# EAGLE design Decoder_relay_4bit_Compact_REV.0 (EAGLE 9.6.2)
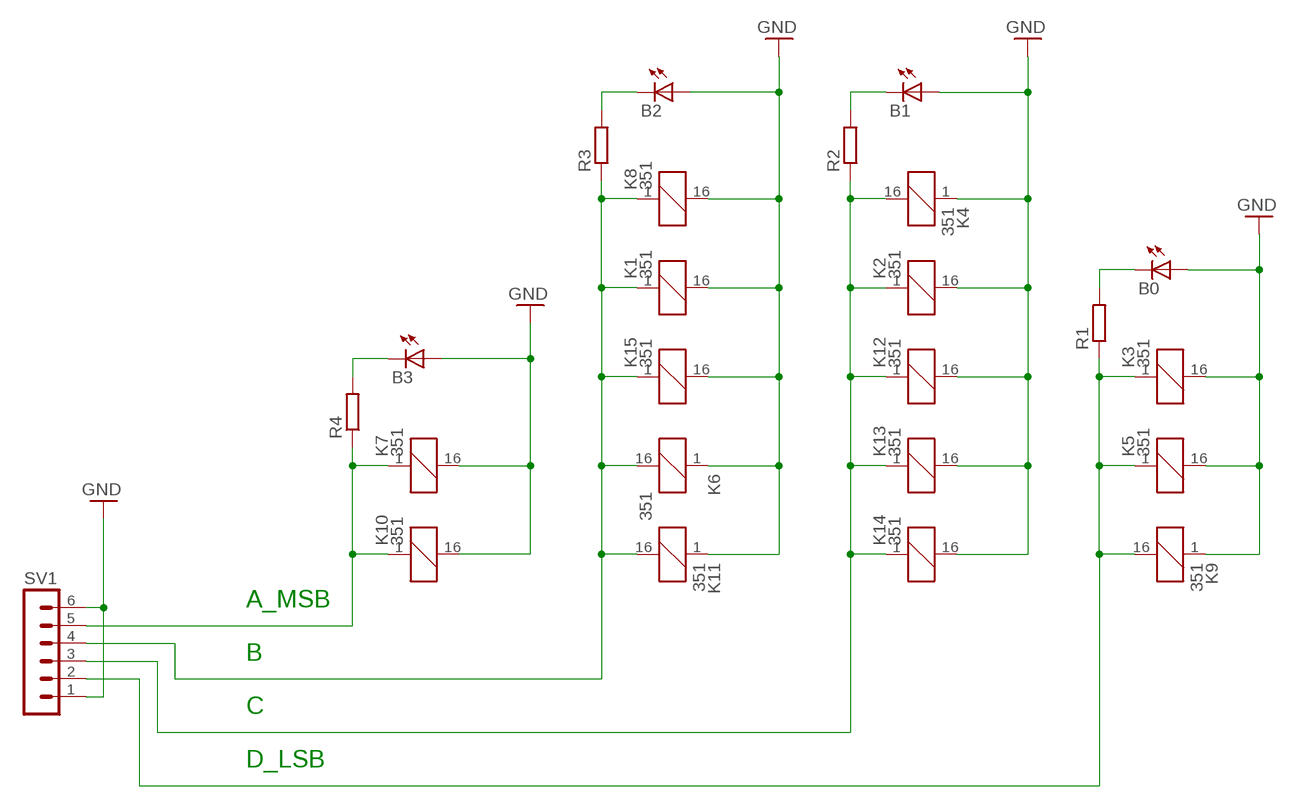
[diagram p0: schematic, sheet 1, part 1 of 2]
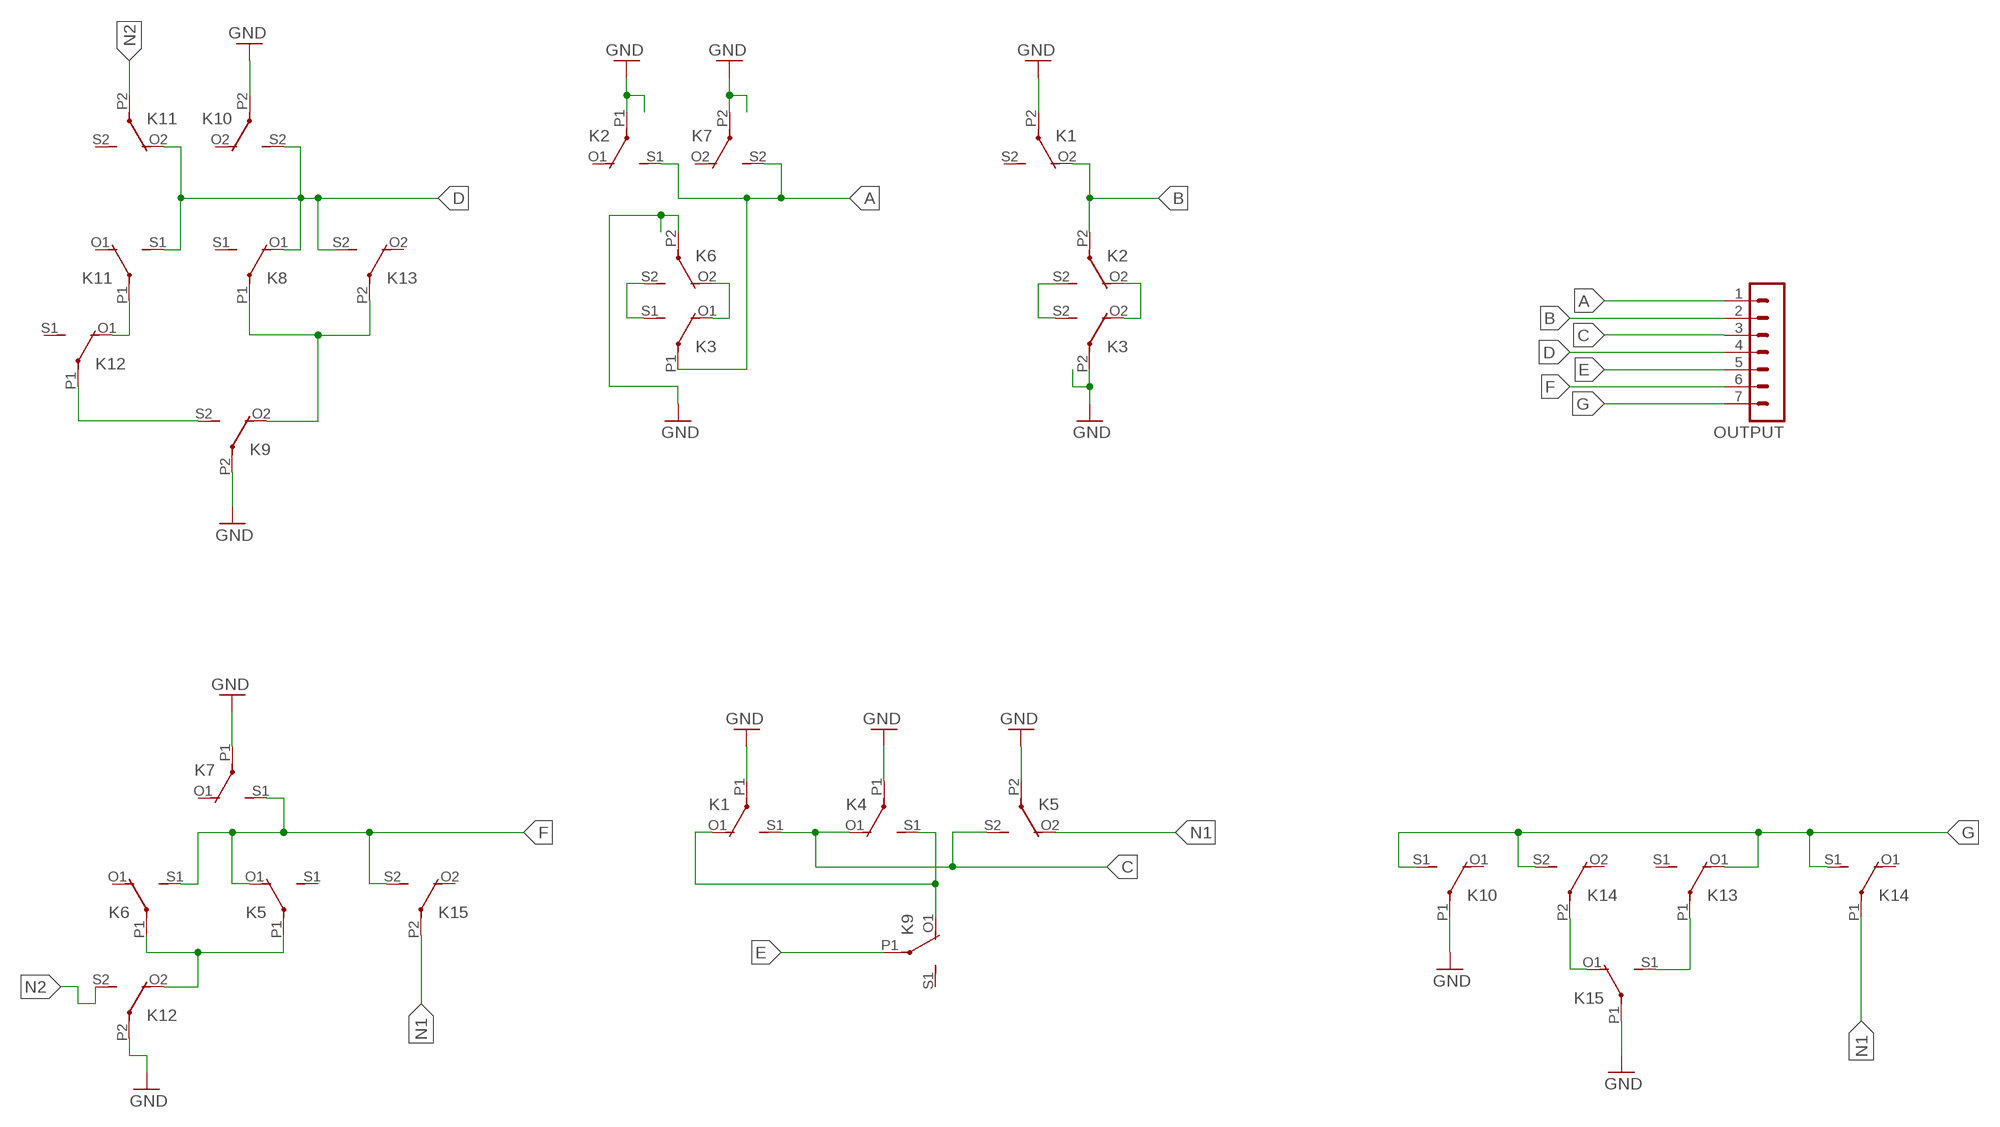
[diagram p1: schematic, sheet 1, part 2 of 2]

## Parts
B0  LED3MM  [LED3MM]
B1  LED3MM  [LED3MM]
B2  LED3MM  [LED3MM]
B3  LED3MM  [LED3MM]
K1  351  [351]
K2  351  [351]
K3  351  [351]
K4  351  [351]
K5  351  [351]
K6  351  [351]
K7  351  [351]
K8  351  [351]
K9  351  [351]
K10  351  [351]
K11  351  [351]
K12  351  [351]
K13  351  [351]
K14  351  [351]
K15  351  [351]
OUTPUT  MA07-1  [MA07-1]
R1  R-EU_M0805  [M0805]
R2  R-EU_M0805  [M0805]
R3  R-EU_M0805  [M0805]
R4  R-EU_M0805  [M0805]
SV1  MA06-1  [MA06-1]

## Nets
A: K2.S1(2:S) K3.P1(2:P) K7.S2(3:S) OUTPUT.1
A3: K7.1 K10.1 R4.1 SV1.5
B: K1.O2(3:O) K2.P2(3:P) OUTPUT.2
C: K1.S1(2:S) K4.O1(2:O) K5.S2(3:S) OUTPUT.3
D: K8.O1(2:O) K10.S2(3:S) K11.O2(3:O) K11.S1(2:S) K13.S2(3:S) OUTPUT.4
E: K9.P1(2:P) OUTPUT.5
F: K5.O1(2:O) K6.S1(2:S) K7.S1(2:S) K15.S2(3:S) OUTPUT.6
G: K10.S1(2:S) K13.O1(2:O) K14.S1(2:S) K14.S2(3:S) OUTPUT.7
GND: B0.A B1.A B2.A B3.A K1.16 K1.P1(2:P) K1.P2(3:P) K2.16 K2.P1(2:P) K3.16 K3.P2(3:P) K4.1 K4.P1(2:P) K5.16 K5.P2(3:P) K6.1 K6.P2(3:P) K7.16 K7.P1(2:P) K7.P2(3:P) K8.16 K9.1 K9.P2(3:P) K10.16 K10.P1(2:P) K10.P2(3:P) K11.1 K12.16 K12.P2(3:P) K13.16 K14.16 K15.16 K15.P1(2:P) SV1.1 SV1.6
N1: K5.O2(3:O) K14.P1(2:P) K15.P2(3:P)
N2: K11.P2(3:P) K12.S2(3:S)
N$2: K8.P1(2:P) K9.O2(3:O) K13.P2(3:P)
N$3: B0.K(C) R1.2
N$4: K2.S2(3:S) K3.S2(3:S)
N$5: B1.K(C) R2.2
N$6: K3.S1(2:S) K6.S2(3:S)
N$8: B2.K(C) R3.2
N$9: B3.K(C) R4.2
N$12: K5.P1(2:P) K6.P1(2:P) K12.O2(3:O)
N$13: K2.O2(3:O) K3.O2(3:O)
N$15: K13.P1(2:P) K15.S1(2:S)
N$16: K14.P2(3:P) K15.O1(2:O)
N$17: K9.S2(3:S) K12.P1(2:P)
N$19: K11.P1(2:P) K12.O1(2:O)
N$26: K3.O1(2:O) K6.O2(3:O)
N$55: K1.O1(2:O) K4.S1(2:S) K9.O1(2:O)
N$58: K1.1 K6.16 K8.1 K11.16 K15.1 R3.1 SV1.4
N$63: K3.1 K5.1 K9.16 R1.1 SV1.2
N$69: K2.1 K4.16 K12.1 K13.1 K14.1 R2.1 SV1.3
Unconnected: K1.S2(3:S) K2.O1(2:O) K4.O2(3:O) K4.P2(3:P) K4.S2(3:S) K5.S1(2:S) K6.O1(2:O) K7.O1(2:O) K7.O2(3:O) K8.O2(3:O) K8.P2(3:P) K8.S1(2:S) K8.S2(3:S) K9.S1(2:S) K10.O1(2:O) K10.O2(3:O) K11.O1(2:O) K11.S2(3:S) K12.S1(2:S) K13.O2(3:O) K13.S1(2:S) K14.O1(2:O) K14.O2(3:O) K15.O2(3:O)

## Notes on the sheet
- A_MSB
- B
- C
- D_LSB

## Library data of the parts
B0 B1-B3 = led:LED: LED OSRAM: - CHIPLED LG R971, LG N971, LY N971, LG Q971, LY Q971, LO R971, LY R971 LH N974, LH R974 LS Q976, LO Q976, LY Q976 LO Q996 - Hyper CHIPLED LW Q18S LB Q993, LB Q99A, LB R99A - SideLED LS A670, LO A670, LY A670, LG A670, LP A670 LB A673, LV A673, LT A673, LW A673 LH A674 LY A675 LS A676, LA A676, LO A676, LY A676, LW A676 LS A679, LY A679, LG A679 - Hyper Micro SIDELED® LS Y876, LA Y876, LO Y876, LY Y876 LT Y87S - SmartLED LW L88C, LW L88S LB L89C, LB L89S, LG L890 LS L89K, LO L89K, LY L89K LS L896, LA L896, LO L896, LY L896 - TOPLED LS T670, LO T670, LY T670, LG T670, LP T670 LSG T670, LSP T670, LSY T670, LOP T670, LYG T670 LG T671, LOG T671, LSG T671 LB T673, LV T673, LT T673, LW T673 LH T674 LS T676, LA T676, LO T676, LY T676, LB T676, LH T676, LSB T676, LW T676 LB T67C, LV T67C, LT T67C, LS T67K, LO T67K, LY T67K, LW E67C LS E67B, LA E67B, LO E67B, LY E67B, LB E67C, LV E67C, LT E67C LW T67C LS T679, LY T679, LG T679 LS T770, LO T770, LY T770, LG T770, LP T770 LB T773, LV T773, LT T773, LW T773 LH T774 LS E675, LA E675, LY E675, LS T675 LS T776, LA T776, LO T776, LY T776, LB T776 LHGB T686 LT T68C, LB T68C - Hyper Mini TOPLED® LB M676 - Mini TOPLED Santana® LG M470 LS M47K, LO M47K, LY M47K Source: http://www.osram.convergy.de LUXEON: - LUMILED® LXK2-PW12-R00, LXK2-PW12-S00, LXK2-PW14-U00, LXK2-PW14-V00 LXK2-PM12-R00, LXK2-PM12-S00, LXK2-PM14-U00 LXK2-PE12-Q00, LXK2-PE12-R00, LXK2-PE12-S00, LXK2-PE14-T00, LXK2-PE14-U00 LXK2-PB12-K00, LXK2-PB12-L00, LXK2-PB12-M00, LXK2-PB14-N00, LXK2-PB14-P00, LXK2-PB14-Q00 LXK2-PR12-L00, LXK2-PR12-M00, LXK2-PR14-Q00, LXK2-PR14-R00 LXK2-PD12-Q00, LXK2-PD12-R00, LXK2-PD12-S00 LXK2-PH12-R00, LXK2-PH12-S00 LXK2-PL12-P00, LXK2-PL12-Q00, LXK2-PL12-R00 Source: www.luxeon.com KINGBRIGHT: KA-3528ASYC Source: www.kingbright.com
K1-K15 = relay:351: RELAY 2 x switch, Omron; OC_FARNELL: unknown; OC_NEWARK: unknown
OUTPUT = con-lstb:MA07-1: PIN HEADER; OC_FARNELL: unknown; OC_NEWARK: unknown
R1-R4 = rcl:R-EU_: RESISTOR, European symbol
SV1 = con-lstb:MA06-1: PIN HEADER; OC_FARNELL: unknown; OC_NEWARK: unknown

## Board
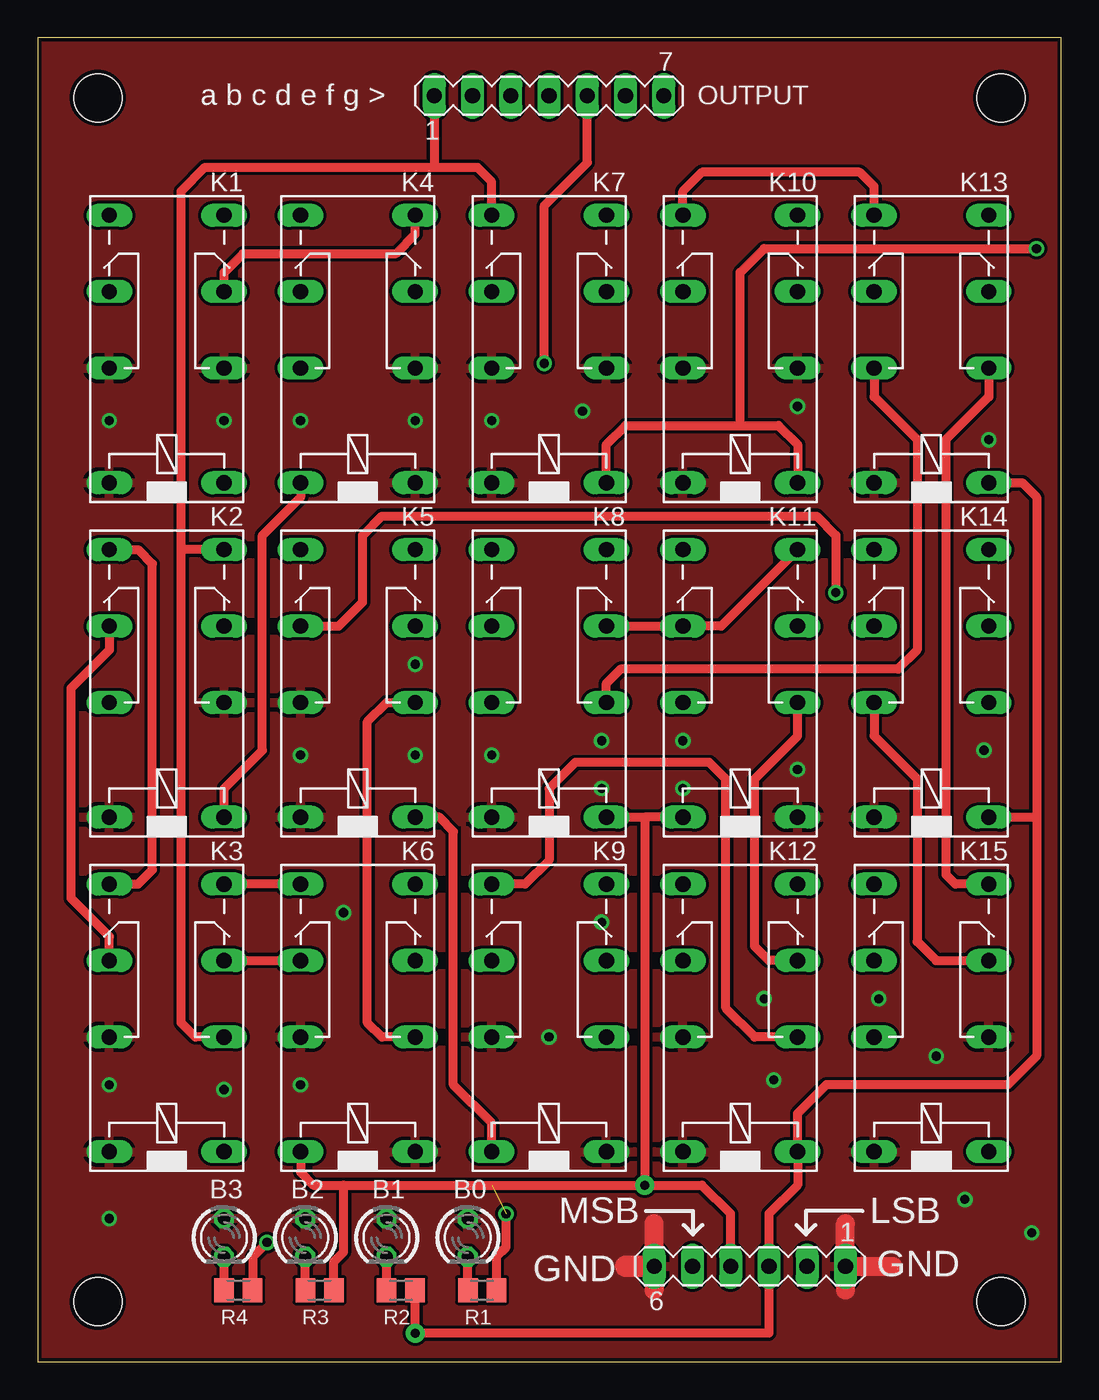
[diagram p2: board, top side]
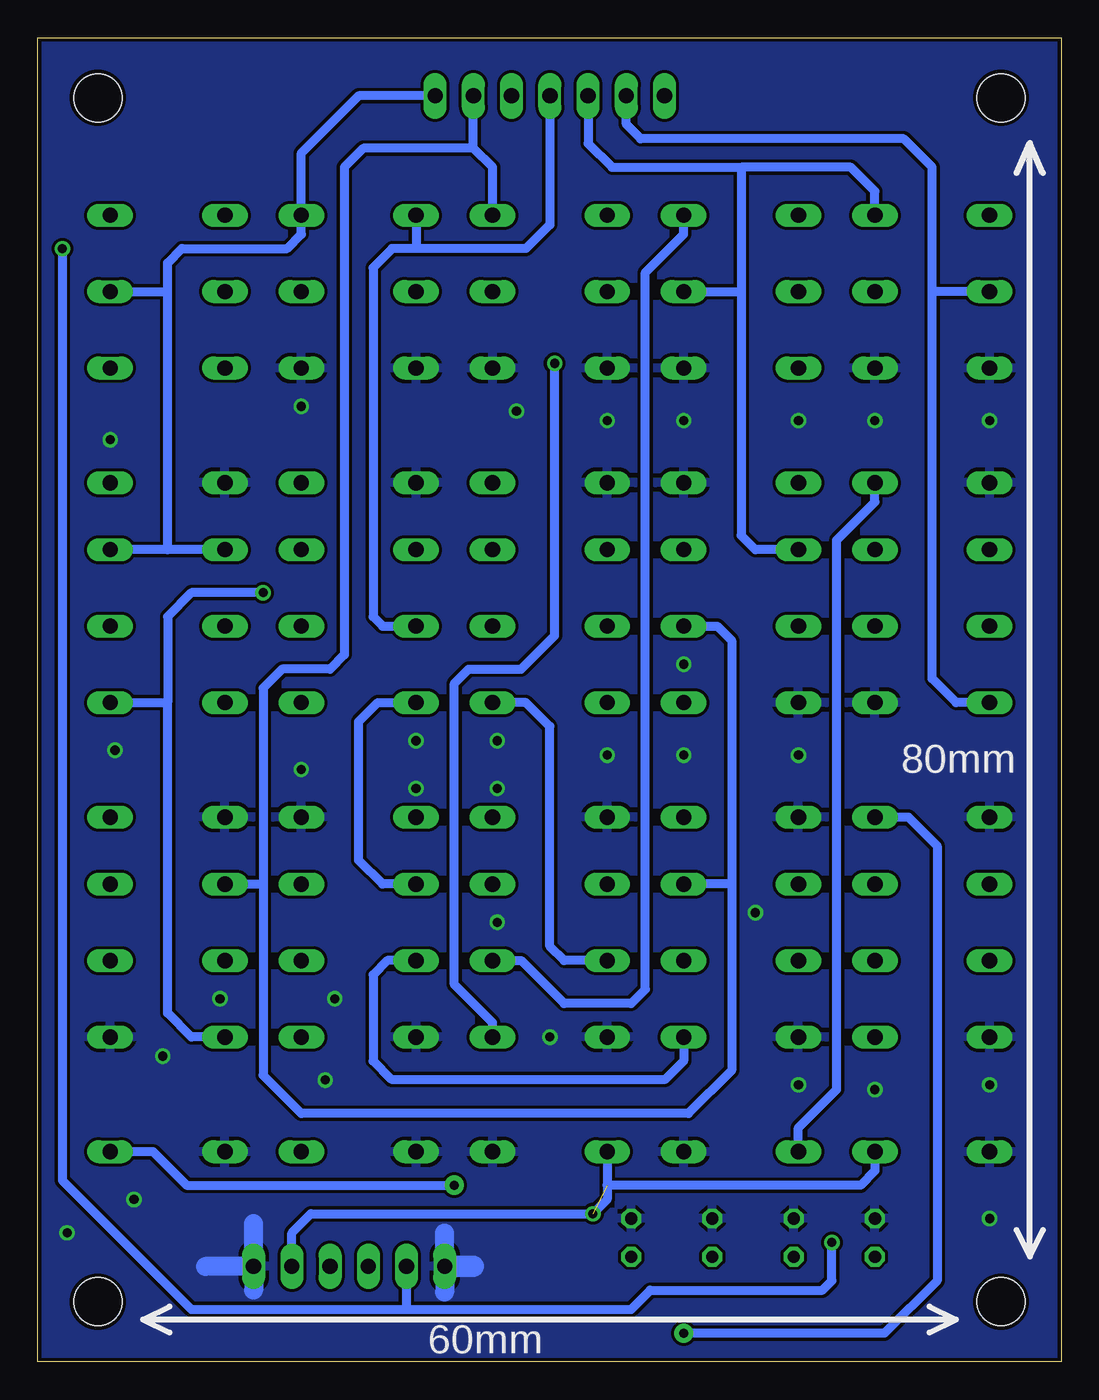
[diagram p3: board, bottom side, seen from below]

Size 68 x 88 mm. Coordinates in mm from the lower left corner, seen from the top.
Outline: 0,0 68,0 68,88 0,88 0,0
Copper layers (1*16): Top 0.035mm / dielectric 1.5mm / Bottom 0.035mm
Design rules "default *": minimum track width 24mil, minimum drill 24mil, track to track 8mil, track to pad 8mil, pad to pad 8mil, via to via 8mil, smd to smd 8mil, copper to edge 10mil, drill to drill 8mil, minimum pad ring 10mil, minimum via ring 8mil, stop-mask expansion 4mil, vias tented up to drill 0mil, thermal gap 10mil
Holes 3.2 mm at 64,84 4,4 4,84 64,4

### Footprints (pad centres in the part's own frame; a part is rotated, then mirrored left to right if it is on the bottom)
LED3MM = drill 0.813 octagon: A -1.27,0; K 1.27,0
351 = drill 1.016 long: 1 -3.81,-3.81; 16 -3.81,3.81; O1 8.89,-3.81; O2 8.89,3.81; P1 3.81,-3.81; P2 3.81,3.81; S1 13.97,-3.81; S2 13.97,3.81
MA07-1 = drill 1.016 long: 1 -7.62,0; 2 -5.08,0; 3 -2.54,0; 4 0,0; 5 2.54,0; 6 5.08,0; 7 7.62,0
M0805 = smd 1.3 x 1.6: 1 -0.95,0; 2 0.95,0
MA06-1 = drill 1.016 long: 1 -6.35,0; 2 -3.81,0; 3 -1.27,0; 4 1.27,0; 5 3.81,0; 6 6.35,0

### Placement (x,y rotation side)
B0  28.57,8.26 270 top
B1  23.18,8.26 270 top
B2  17.78,8.26 270 top
B3  12.38,8.26 270 top
K1  8.57,62.23 90 top
K2  8.57,40.01 90 top
K3  8.57,17.78 90 top
K4  21.27,62.23 90 top
K5  21.27,40.01 90 top
K6  21.27,17.78 90 top
K7  33.97,62.23 90 top
K8  33.97,40.01 90 top
K9  33.97,17.78 90 top
K10  46.67,62.23 90 top
K11  46.67,40.01 90 top
K12  46.67,17.78 90 top
K13  59.37,62.23 90 top
K14  59.37,40.01 90 top
K15  59.37,17.78 90 top
OUTPUT  33.97,84.14 0 top
R1  29.53,4.76 180 top
R2  24.13,4.76 180 top
R3  18.73,4.76 180 top
R4  13.34,4.76 180 top
SV1  47.31,6.35 180 top

### Tracks (layer width: path | path; a pad name or v marks a point on that pad's centre or on a via)
A
  Top 0.61: K3.P1 10.48,21.59 9.53,22.54 9.53,53.98 | 9.53,53.98 9.53,77.79 11.11,79.38 26.35,79.38 | K2.S1 9.53,53.98 | 26.35,79.38 29.21,79.38 30.16,78.42 K7.S2 | OUTPUT.1 26.35,79.38
A3  (via drill 0.61)
  Top 0.61: K7.1 37.78,60.96 39.05,62.23 46.67,62.23 | 46.67,62.23 49.21,62.23 50.48,60.96 K10.1 | 46.67,62.23 46.67,72.39 48.26,73.98 v66.36,73.98 | v15.24,7.94 14.29,6.98 R4.1
  Bottom 0.61: 43.5,3.49 57.78,3.49 66.36,12.06 v66.36,73.98 | SV1.5 43.5,3.49 | 43.5,3.49 28.57,3.49 27.3,4.76 15.88,4.76 15.24,5.4 v15.24,7.94
B
  Bottom 0.61: 8.57,71.12 8.57,45.4 6.99,43.81 K2.P2 | 8.57,71.12 8.57,79.38 10.48,81.28 27.94,81.28 28.89,82.23 OUTPUT.2 | K1.O2 8.57,71.12
C
  Bottom 0.61: K1.S1 12.38,77.79 13.97,79.38 21.27,79.38 | K5.S2 20.32,53.98 21.27,54.93 21.27,71.12 | 21.27,79.38 21.27,71.12 | K4.O1 21.27,71.12 | OUTPUT.3 31.43,80.96 29.84,79.38 21.27,79.38
D
  Top 0.61: K11.S1 45.4,48.9 K11.O2 K8.O1 | K10.S2 42.86,77.79 44.13,79.06 54.61,79.06 55.56,78.11 K13.S2
  Bottom 0.61: OUTPUT.4 33.97,75.56 35.56,73.98 42.86,73.98 | K10.S2 42.86,73.98 | 42.86,73.98 44.45,73.98 45.72,72.71 45.72,49.53 45.09,48.9 K11.O2
E  (via drill 0.61)
  Top 0.61: v33.66,66.36 33.66,76.83 36.51,79.69 OUTPUT.5
  Bottom 0.61: K9.P1 37.78,22.54 40.32,25.08 40.32,45.09 39.37,46.04 35.88,46.04 33.66,48.26 v33.66,66.36
F
  Bottom 0.61: 21.91,31.75 K6.S1 | K5.O1 22.86,48.9 21.91,47.94 21.91,31.75 | K7.S1 37.78,79.38 39.05,80.64 | 39.05,80.64 OUTPUT.6 | 39.05,80.64 46.35,80.64 47.62,79.38 47.62,46.99 48.58,46.04 51.75,46.04 53.02,44.77 53.02,31.75 | 21.91,31.75 21.91,19.37 24.77,16.51 50.48,16.51 53.02,19.05 53.02,31.75 | K15.S2 53.02,31.75
G
  Bottom 0.61: K14.S2 59.37,53.98 | 59.37,53.98 K14.S1 | OUTPUT.7 46.67,84.14 50.48,80.33 K10.S1 50.48,74.93 51.44,73.98 58.42,73.98 59.37,73.03 59.37,71.12 | 59.37,53.98 59.37,71.12 | K13.O1 59.37,71.12
GND  (via drill 0.61)
  Top 1.27: SV1.1 56.83,6.35 | SV1.1 53.66,9.21 | SV1.1 53.66,4.76 | 40.96,9.21 SV1.6 40.96,4.76
  Top 1.422: 39.05,6.35 SV1.6
  Bottom 1.27: 40.96,8.57 SV1.6 40.96,4.64 | SV1.1 53.66,4.76 | SV1.1 53.66,9.21 | SV1.1 56.83,6.35
  Bottom 1.422: 39.05,6.35 SV1.6
  other vias: 25.08,40.32 25.08,46.35 37.47,38.1 37.47,41.27 42.86,41.27 42.86,38.1 37.47,29.21 4.76,62.55 12.38,62.55 25.08,62.55 30.16,62.55 17.46,62.55 62.87,40.64 30.16,40.32 17.46,40.32 4.76,18.41 12.38,18.1 17.46,18.41 33.97,21.59 48.9,18.73 59.69,20.32 36.2,63.18 50.48,63.5 63.18,61.28 50.48,39.37 48.26,24.13 55.88,24.13 20.32,29.84 4.76,9.53 61.59,10.79 66.04,8.57
  pour Top: -2.54,-2.54 70.54,-2.54 70.54,90.54 -2.54,90.54
  pour Bottom: -1.27,-1.27 69.27,-1.27 69.27,89.27 -1.27,89.27
N1  (via drill 0.61)
  Top 0.61: K5.O2 20,48.9 21.59,50.48 21.59,54.93 22.86,56.2 51.75,56.2 53.02,54.93 v53.02,51.12
  Bottom 0.61: K14.P1 59.37,43.81 | K15.P2 57.78,21.59 59.37,23.18 59.37,43.81 | v53.02,51.12 57.78,51.12 59.37,49.53 59.37,43.81
N2
  Bottom 0.61: K12.S2 45.09,31.75 46.67,33.34 46.67,42.55 45.4,43.81 K11.P2
N$2
  Top 0.61: K8.P1 37.78,45.09 38.73,46.04 57.15,46.04 58.42,47.31 58.42,61.28 55.56,64.14 K13.P2
  Bottom 0.61: K9.O2 33.02,26.67 33.97,27.62 33.97,42.23 35.56,43.81 K8.P1
N$3
  Top 0.61: R1.2 B0.K
N$4
  Top 0.61: K3.S2 6.67,31.75 7.62,32.7 7.62,53.02 6.67,53.98 K2.S2
N$5
  Top 0.61: R2.2 B1.K
N$6
  Top 0.61: K6.S2 K3.S1
N$8
  Top 0.61: R3.2 B2.K
N$9
  Top 0.61: R4.2 B3.K
N$12
  Top 0.61: K6.P1 22.86,21.59 21.91,22.54 21.91,42.55 23.18,43.81 K5.P1
  Bottom 0.61: K6.P1 25.08,20 26.3,18.79 44.51,18.79 45.72,20 45.72,25.72 44.77,26.67 K12.O2
N$13
  Top 0.61: K3.O2 4.76,28.26 2.22,30.8 2.22,44.77 4.76,47.31 K2.O2
N$15
  Top 0.61: K13.P1 63.18,64.14 60.33,61.28 60.33,32.38 60.96,31.75 K15.S1
N$16
  Top 0.61: K15.O1 59.69,26.67 58.42,27.94 58.42,38.73 55.56,41.59 K14.P2
N$17
  Top 0.61: K12.P1 47.62,21.59 45.72,23.5 45.72,38.73 44.61,39.85 35.72,39.85 33.97,38.1 33.97,33.34 32.38,31.75 K9.S2
N$19
  Top 0.61: K12.O1 48.58,26.67 47.62,27.62 47.62,38.73 50.48,41.59 K11.P1
N$26
  Top 0.61: K3.O1 K6.O2
N$55
  Top 0.61: K1.O1 12.38,72.39 13.65,73.66 23.81,73.66 25.08,74.93 K4.S1
  Bottom 0.61: K9.O1 35.88,26.67 33.02,23.81 28.57,23.81 27.62,24.77 27.62,72.39 25.08,74.93 K4.S1
N$58  (via drill 0.6 pad 1.27)
  Top 0.61: 40.32,36.2 v40.32,11.75 | K6.16 17.46,12.61 18.32,11.75 20.32,11.75 | SV1.4 46.04,9.84 44.13,11.75 v40.32,11.75 | K11.16 40.32,36.2 | K8.1 40.32,36.2 | 20.32,11.75 v40.32,11.75 | R3.1 19.68,6.67 20.32,7.3 20.32,11.75
  Bottom 0.61: v40.32,11.75 58.1,11.75 60.33,13.97 K15.1 | K6.16 17.46,15.56 14.92,18.1 14.92,54.61 12.38,57.15 K1.1
N$63  (via drill 0.61)  (1 unrouted)
  Top 0.61: K5.1 26.67,36.2 27.62,35.24 27.62,18.41 30.16,15.88 K9.16 | v31.11,9.84 31.11,7.62 30.48,6.98 R1.1
  Bottom 0.61: SV1.2 51.12,8.57 49.85,9.84 v31.11,9.84 30.16,10.79 K9.16 | K3.1 12.38,12.7 13.34,11.75 30.16,11.75
N$69  (via drill 0.6 pad 1.27)
  Top 0.61: K2.1 12.38,38.1 14.92,40.64 14.92,54.93 17.46,57.47 K4.16 | 66.36,36.2 66.36,20.32 64.45,18.41 52.39,18.41 50.48,16.51 K12.1 50.48,11.75 48.58,9.84 SV1.3 48.58,1.91 v25.08,1.91 R2.1 | 66.36,36.2 66.36,57.47 65.41,58.42 K13.1 | K14.1 66.36,36.2
  Bottom 0.61: K2.1 10.16,36.2 8.26,34.29 8.26,5.4 11.75,1.91 v25.08,1.91

### Text on the board
tPlace: a b c d e f g > | a b c d e f g >
tNames: MSB | LSB | GND | GND
bNames: 80mm | 60mm